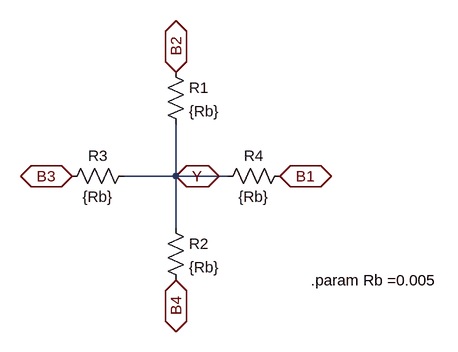
[diagram p0: schematic PV_Motif_Bottom_Plate.asc]
PV_Motif_Bottom_Plate.asc, the LTspice schematic file:
Version 4
SHEET 1 880 680
WIRE 240 208 240 128
WIRE 240 208 160 208
WIRE 320 208 240 208
WIRE 240 288 240 208
FLAG 240 208 Y
IOPIN 240 208 BiDir
FLAG 240 48 B2
IOPIN 240 48 BiDir
FLAG 400 208 B1
IOPIN 400 208 BiDir
FLAG 240 368 B4
IOPIN 240 368 BiDir
FLAG 80 208 B3
IOPIN 80 208 BiDir
SYMBOL res 224 32 R0
SYMATTR InstName R1
SYMATTR Value {Rb}
SYMBOL res 224 272 R0
SYMATTR InstName R2
SYMATTR Value {Rb}
SYMBOL res 176 192 R90
WINDOW 0 0 56 VBottom 2
WINDOW 3 32 56 VTop 2
SYMATTR InstName R3
SYMATTR Value {Rb}
SYMBOL res 416 192 R90
WINDOW 0 0 56 VBottom 2
WINDOW 3 32 56 VTop 2
SYMATTR InstName R4
SYMATTR Value {Rb}
TEXT 448 368 Left 2 !.param Rb =0.005

The netlist it stands for:
* PV_Motif_Bottom_Plate.asc
R1 B2 Y {Rb}
R2 Y B4 {Rb}
R3 Y B3 {Rb}
R4 B1 Y {Rb}
.param Rb =0.005
.backanno
.end